# EAGLE design VC Panning Mixer CTRL (EAGLE 7.7.0)
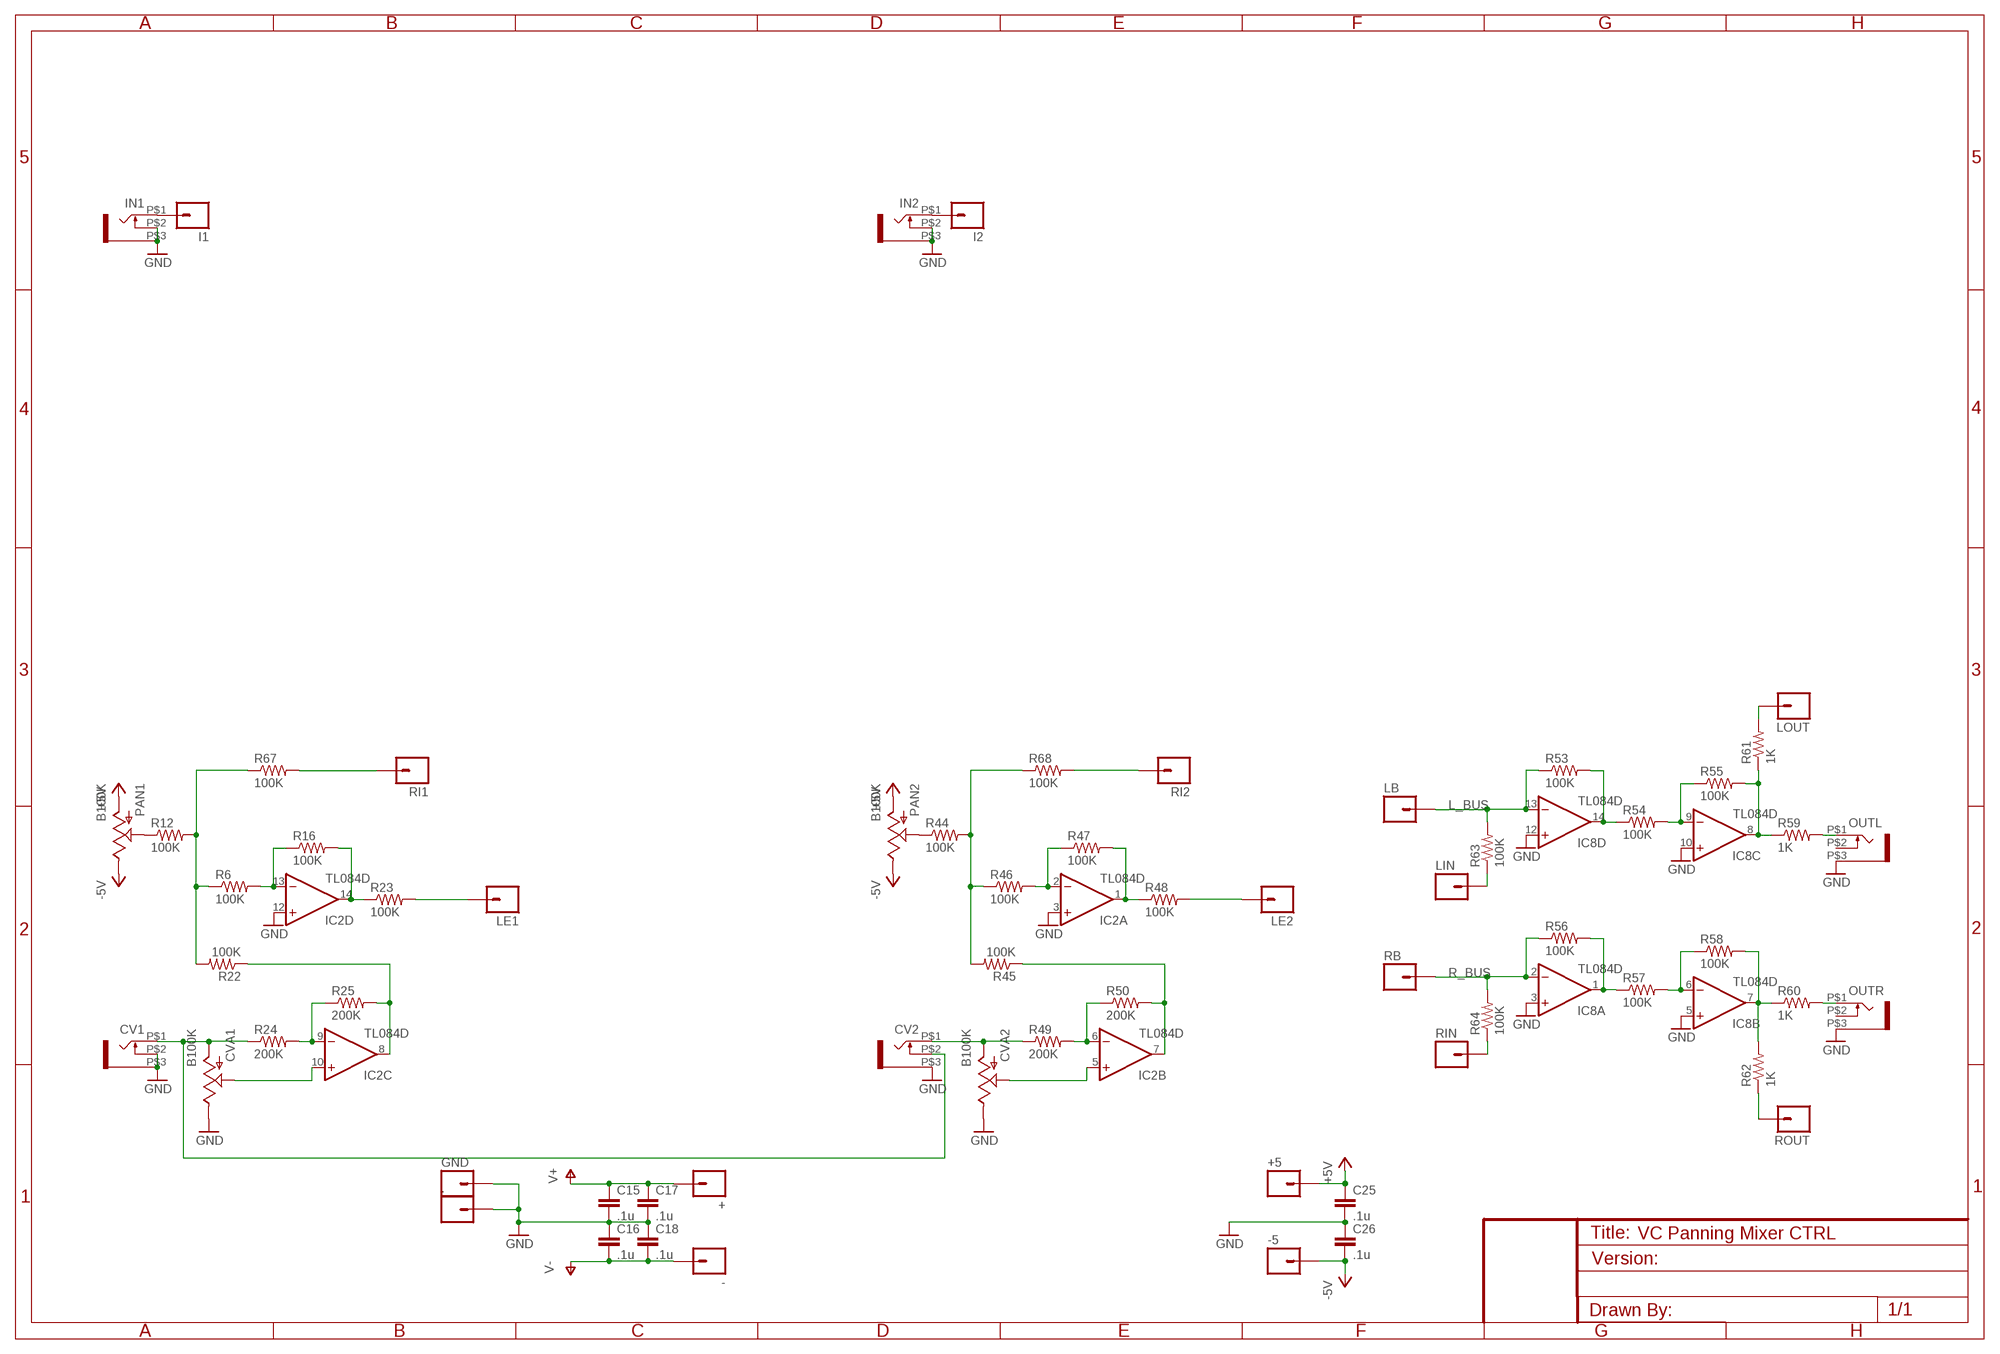
[diagram p0: schematic, sheet 1]

## Parts
+  M01PTH  [1X01]
+5  M01PTH  [1X01]
-  M01PTH  [1X01]
-5  M01PTH  [1X01]
.  M01PTH  [1X01]
C15  .1u  CAP0805  [0805]
C16  .1u  CAP0805  [0805]
C17  .1u  CAP0805  [0805]
C18  .1u  CAP0805  [0805]
C25  .1u  CAP0805  [0805]
C26  .1u  CAP0805  [0805]
CV1  WQP-PJ301M-12_JACK  [WQP-PJ301M-12_JACK]
CV2  WQP-PJ301M-12_JACK  [WQP-PJ301M-12_JACK]
CVA1  B100K  POT  [ALPS_POT]
CVA2  B100K  POT  [ALPS_POT]
GND  M01PTH  [1X01]
I1  M01PTH  [1X01]
I2  M01PTH  [1X01]
IC2  TL084D  [SO14]
IC8  TL084D  [SO14]
IN1  WQP-PJ301M-12_JACK  [WQP-PJ301M-12_JACK]
IN2  WQP-PJ301M-12_JACK  [WQP-PJ301M-12_JACK]
LB  M01PTH  [1X01]
LE1  M01PTH  [1X01]
LE2  M01PTH  [1X01]
LIN  M01PTH  [1X01]
LOUT  M01PTH  [1X01]
OUTL  WQP-PJ301M-12_JACK  [WQP-PJ301M-12_JACK]
OUTR  WQP-PJ301M-12_JACK  [WQP-PJ301M-12_JACK]
PAN1  B100K  POT  [ALPS_POT]
PAN2  B100K  POT  [ALPS_POT]
R6  100K  RESISTOR0805-RES  [0805]
R12  100K  RESISTOR0805-RES  [0805]
R16  100K  RESISTOR0805-RES  [0805]
R22  100K  RESISTOR0805-RES  [0805]
R23  100K  RESISTOR0805-RES  [0805]
R24  200K  RESISTOR0805-RES  [0805]
R25  200K  RESISTOR0805-RES  [0805]
R44  100K  RESISTOR0805-RES  [0805]
R45  100K  RESISTOR0805-RES  [0805]
R46  100K  RESISTOR0805-RES  [0805]
R47  100K  RESISTOR0805-RES  [0805]
R48  100K  RESISTOR0805-RES  [0805]
R49  200K  RESISTOR0805-RES  [0805]
R50  200K  RESISTOR0805-RES  [0805]
R53  100K  RESISTOR0805-RES  [0805]
R54  100K  RESISTOR0805-RES  [0805]
R55  100K  RESISTOR0805-RES  [0805]
R56  100K  RESISTOR0805-RES  [0805]
R57  100K  RESISTOR0805-RES  [0805]
R58  100K  RESISTOR0805-RES  [0805]
R59  1K  RESISTOR0805-RES  [0805]
R60  1K  RESISTOR0805-RES  [0805]
R61  1K  RESISTOR0805-RES  [0805]
R62  1K  RESISTOR0805-RES  [0805]
R63  100K  RESISTOR0805-RES  [0805]
R64  100K  RESISTOR0805-RES  [0805]
R67  100K  RESISTOR0805-RES  [0805]
R68  100K  RESISTOR0805-RES  [0805]
RB  M01PTH  [1X01]
RI1  M01PTH  [1X01]
RI2  M01PTH  [1X01]
RIN  M01PTH  [1X01]
ROUT  M01PTH  [1X01]

## Nets
+5V: +5.1 C25.1 PAN1.P$3(A) PAN2.P$3(A)
-5V: -5.1 C26.2 PAN1.P$1(E) PAN2.P$1(E)
GND: ..1 C15.2 C16.1 C17.2 C18.1 C25.2 C26.1 CV1.P$2 CV1.P$3 CV2.P$3 CVA1.P$1(E) CVA2.P$1(E) GND.1 IC2.3(A:+IN) IC2.12(D:+IN) IC8.3(A:+IN) IC8.5(B:+IN) IC8.10(C:+IN) IC8.12(D:+IN) IN1.P$2 IN1.P$3 IN2.P$2 IN2.P$3 OUTL.P$3 OUTR.P$3
L_BUS: IC8.13(D:-IN) LB.1 R53.1 R63.2
N$1: R68.2 RI2.1
N$2: R67.2 RI1.1
N$4: I1.1 IN1.P$1
N$5: I2.1 IN2.P$1
N$6: R6.1 R12.2 R22.2 R67.1
N$7: LE1.1 R23.2
N$8: LE2.1 R48.2
N$9: R44.2 R45.2 R46.1 R68.1
N$11: PAN1.P$2(S) R12.1
N$26: CV1.P$1 CV2.P$2 CVA1.P$3(A) R24.1
N$27: CVA1.P$2(S) IC2.10(C:+IN)
N$28: IC2.9(C:-IN) R24.2 R25.1
N$29: IC2.8(C:OUT) R22.1 R25.2
N$30: IC2.13(D:-IN) R6.2 R16.1
N$31: IC2.14(D:OUT) R16.2 R23.1
N$55: PAN2.P$2(S) R44.1
N$56: CV2.P$1 CVA2.P$3(A) R49.1
N$57: CVA2.P$2(S) IC2.5(B:+IN)
N$58: IC2.6(B:-IN) R49.2 R50.1
N$59: IC2.7(B:OUT) R45.1 R50.2
N$60: IC2.2(A:-IN) R46.2 R47.1
N$61: IC2.1(A:OUT) R47.2 R48.1
N$62: IC8.14(D:OUT) R53.2 R54.1
N$63: IC8.9(C:-IN) R54.2 R55.1
N$64: IC8.8(C:OUT) R55.2 R59.1 R61.1
N$65: IC8.1(A:OUT) R56.2 R57.1
N$66: IC8.6(B:-IN) R57.2 R58.1
N$67: IC8.7(B:OUT) R58.2 R60.1 R62.2
N$68: OUTL.P$1 R59.2
N$69: OUTR.P$1 R60.2
N$70: R64.1 RIN.1
N$71: LIN.1 R63.1
N$72: LOUT.1 R61.2
N$74: R62.1 ROUT.1
R_BUS: IC8.2(A:-IN) R56.1 R64.2 RB.1
V+: +.1 C15.1 C17.1
V-: -.1 C16.2 C18.2
Unconnected: OUTL.P$2 OUTR.P$2

## Power pins joined to a net without a drawn wire
V+: IC2.4(P:V+) IC8.4(P:V+)
V-: IC2.11(P:V-) IC8.11(P:V-)

## Library data of the parts
+ +5 - -5 . GND I1 I2 LB LE1 LE2 LIN LOUT RB RI1 RI2 RIN ROUT = SparkFun-Connectors:M01: Header 1 Standard 1-pin 0.1" header. Use with straight break away headers (SKU : PRT-00116), right angle break away headers (PRT-00553), swiss pins (PRT-00743), machine pins (PRT-00117), and female headers (PRT-00115).
C15-C18 C25 C26 = SparkFun-Capacitors:CAP: Capacitor Standard 0603 ceramic capacitor, and 0.1" leaded capacitor.
CV1 CV2 IN1 IN2 OUTL OUTR = thonkiconn:WQP-PJ301M-12_JACK
CVA1 CVA2 PAN1 PAN2 = SparkFun-Electromechanical:POT; PROD_ID: RES-09177
IC2 IC8 = linear:TL084: OP AMP
R6 R12 R16 R22-R25 R44-R50 R53-R64 R67 R68 = SparkFun-Resistors:RESISTOR: Resistor Basic schematic elements and footprints for 0603, 1206, and PTH resistors.

## Board
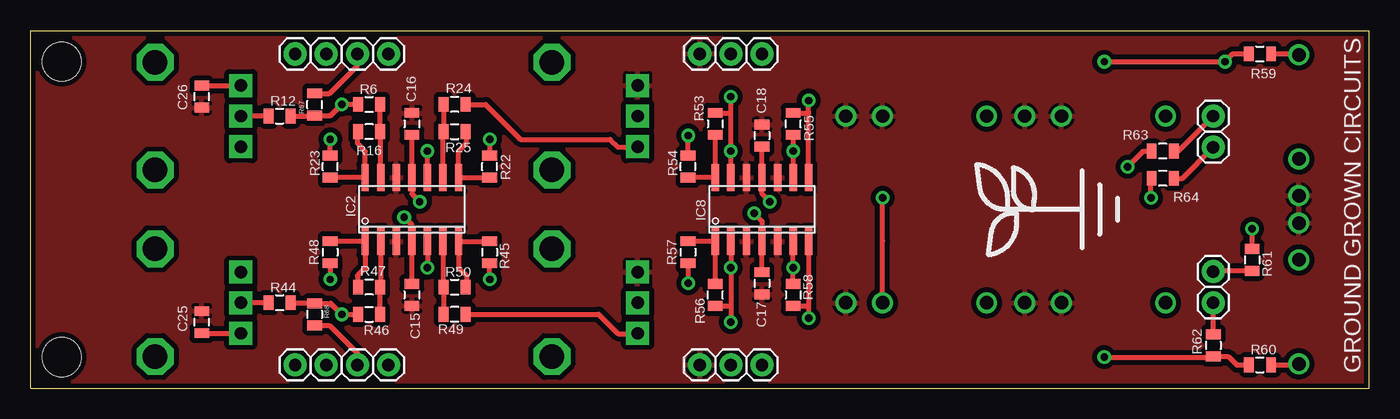
[diagram p1: board, top side]
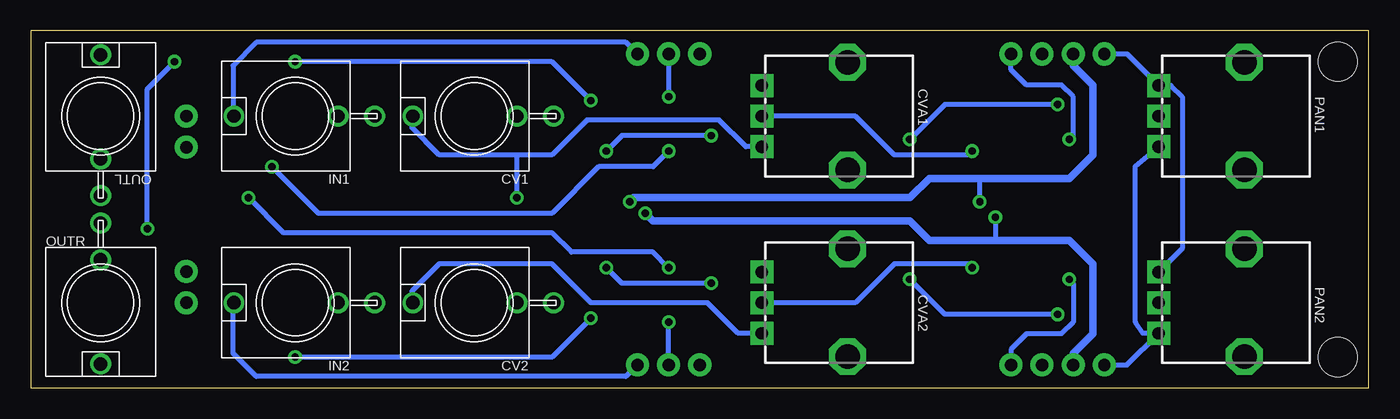
[diagram p2: board, bottom side, seen from below]

Size 109.22 x 29.21 mm. Coordinates in mm from the lower left corner, seen from the top.
Outline: 0,0 109.22,0 109.22,29.21 0,29.21 0,0
Copper layers (1*16): Top 0.035mm / dielectric 1.5mm / Bottom 0.035mm
Design rules "SparkFun": minimum track width 8mil, minimum drill 20mil, track to track 8mil, track to pad 8mil, pad to pad 8mil, via to via 8mil, smd to smd 8mil, copper to edge 8mil, drill to drill 8mil, minimum pad ring 12mil, minimum via ring 10mil, stop-mask expansion 4mil, vias tented up to drill 20mil, thermal gap 10mil
Holes 3.2 mm at 2.54,26.67 2.54,2.54

### Footprints (pad centres in the part's own frame; a part is rotated, then mirrored left to right if it is on the bottom)
1X01 = drill 1.016 pad 1.88: 1 0,0
0805 = smd 0.8 x 1.2: 1 -0.9,0; 2 0.9,0
WQP-PJ301M-12_JACK = drill 1.1: P$1 0,5; P$2 0,-3.5; P$3 0,-6.5
ALPS_POT = drill 1 pad 1.88 square: P$1 7,-2.5; P$2 7,0; P$3 7,2.5 | drill 2 octagon: P$4 0,-4.4; P$5 0,4.4
SO14 = smd 0.6 x 2.2: 1 -3.81,-2.6; 2 -2.54,-2.6; 3 -1.27,-2.6; 4 0,-2.6; 5 1.27,-2.6; 6 2.54,-2.6; 7 3.81,-2.6; 8 3.81,2.6; 9 2.54,2.6; 10 1.27,2.6; 11 0,2.6; 12 -1.27,2.6; 13 -2.54,2.6; 14 -3.81,2.6

### Placement (x,y rotation side)
+  24.13,1.91 0 top
+5  21.59,1.91 0 top
-  24.13,27.3 180 top
-5  21.59,27.3 180 top
.  54.61,27.3 180 top
C15  31.11,7.62 270 top
C16  31.11,21.59 270 top
C17  59.69,8.57 270 top
C18  59.69,20.64 270 top
C25  13.97,5.4 90 top
C26  13.97,23.81 90 top
CV1  73.03,22.23 90 bottom
CV2  73.03,6.99 90 bottom
CVA1  42.55,22.23 180 bottom
CVA2  42.55,6.99 180 bottom
GND  54.61,1.91 0 top
I1  59.69,27.3 180 top
I2  59.69,1.91 0 top
IC2  31.11,14.61 0 top
IC8  59.69,14.61 0 top
IN1  87.63,22.23 90 bottom
IN2  87.63,6.99 90 bottom
LB  57.15,27.3 180 top
LE1  29.21,27.3 180 top
LE2  29.21,1.91 0 top
LIN  96.52,22.23 270 top
LOUT  96.52,9.53 90 top
OUTL  103.5,22.23 0 bottom
OUTR  103.5,6.99 180 bottom
PAN1  10.16,22.23 180 bottom
PAN2  10.16,6.99 180 bottom
R6  27.62,23.18 0 top
R12  20.32,22.23 0 top
R16  27.62,20.95 180 top
R22  37.47,18.1 90 top
R23  24.45,18.1 90 top
R24  34.61,23.18 180 top
R25  34.61,20.95 0 top
R44  20.32,6.99 0 top
R45  37.47,11.11 270 top
R46  27.62,6.03 0 top
R47  27.62,8.26 180 top
R48  24.45,11.11 270 top
R49  34.61,6.03 180 top
R50  34.61,8.26 0 top
R53  55.88,21.59 270 top
R54  53.66,18.1 90 top
R55  62.23,21.59 90 top
R56  55.88,7.62 90 top
R57  53.66,11.11 270 top
R58  62.23,7.62 270 top
R59  100.33,27.3 0 top
R60  100.33,1.91 0 top
R61  99.69,10.48 270 top
R62  96.52,3.49 270 top
R63  92.39,19.37 180 top
R64  92.39,17.14 180 top
R67  23.18,23.18 90 top
R68  23.18,6.03 270 top
RB  57.15,1.91 0 top
RI1  26.67,27.3 180 top
RI2  26.67,1.91 0 top
RIN  96.52,19.68 270 top
ROUT  96.52,6.99 90 top
U$1  [LOGO_MED]  85.72,14.61 90 top

### Tracks (layer width: path | path; a pad name or v marks a point on that pad's centre or on a via)
+5V
  Top 0.406: C25.1 17.15,4.5 PAN2.P$3
  Bottom 0.406: +5.1 19.74,1.91 PAN2.P$3 18.45,4.49 19.05,5.4 19.05,18.15 PAN1.P$3
-5V
  Top 0.406: C26.2 17.15,24.71 PAN1.P$1
  Bottom 0.406: -5.1 19.74,27.3 PAN1.P$1 16.15,24.73 15.24,23.81 15.24,11.4 PAN2.P$1
GND
  pour Top (isolate 0.406): 0,0 109.22,0 109.22,29.21 0,29.21
L_BUS  (via drill 0.6)
  Top 0.406: v57.15,23.81 57.15,22.54 57.1,22.49 | R53.1 57.1,22.49 | IC8.13 v57.15,19.37 57.15,22.44 57.1,22.49 | v89.53,18.1 90.81,19.37 R63.2
  Bottom 0.406: LB.1 v57.15,23.81 | v57.15,19.37 58.42,18.1 62.87,18.1 66.67,14.29 85.72,14.29 v89.53,18.1
N$1
  Top 0.406: R68.2 24.39,5.13 26.67,2.86 RI2.1
N$2
  Top 0.406: R67.2 24.39,24.08 26.67,26.35 RI1.1
N$4
  Bottom 0.406: I1.1 60.64,28.26 90.81,28.26 92.71,26.35 92.71,22.3 IN1.P$1
N$5
  Bottom 0.406: I2.1 60.64,0.95 90.81,0.95 92.71,2.86 92.71,6.91 IN2.P$1
N$6  (via drill 0.6)
  Top 0.406: v37.47,20.32 R22.2 | R6.1 v25.4,23.18 24.5,22.28 R67.1 23.12,22.23 R12.2
  Bottom 0.406: v25.4,23.18 34.61,23.18 v37.47,20.32
N$7  (via drill 0.6)
  Top 0.406: R23.2 v24.45,20.32
  Bottom 0.406: v24.45,20.32 24.13,20.64 24.13,23.81 25.08,24.77 27.94,24.77 29.21,26.04 LE1.1
N$8  (via drill 0.6)
  Top 0.406: R48.2 v24.45,8.89
  Bottom 0.406: v24.45,8.89 24.13,8.57 24.13,5.4 25.08,4.45 27.94,4.45 29.21,3.17 LE2.1
N$9  (via drill 0.6)
  Top 0.406: v37.47,8.89 R45.2 | R46.1 v25.4,6.03 24.5,6.93 R68.1 23.18,6.99 R44.2
  Bottom 0.406: v25.4,6.03 34.61,6.03 v37.47,8.89
N$11
  Top 0.406: R12.1 PAN1.P$2
N$26  (via drill 0.6)
  Top 0.406: R24.1 37.15,23.18 40.01,20.32 47.31,20.32 47.94,19.68 49.51,19.68 CVA1.P$3 | CV2.P$2 69.53,12.06 v69.53,15.56
  Bottom 0.406: CVA1.P$3 50.84,19.73 53.02,21.91 63.82,21.91 66.67,19.05 69.53,19.05 | 69.53,19.05 75.88,19.05 78.11,21.27 78.11,22.14 CV1.P$1 | v69.53,15.56 69.53,19.05
N$27  (via drill 0.6)
  Top 0.406: IC2.10 v32.38,19.37
  Bottom 0.406: v32.38,19.37 32.7,19.05 38.73,19.05 41.91,22.23 CVA1.P$2
N$28
  Top 0.406: R24.2 R25.1 33.66,20.9 IC2.9
N$29
  Top 0.406: R25.2 35.56,20.9 35.56,20 34.92,19.37 IC2.8 37.46,17.2 R22.1
N$30
  Top 0.406: R6.2 R16.1 28.57,20.9 IC2.13
N$31
  Top 0.406: R16.2 26.67,20.9 26.67,20 27.3,19.37 IC2.14 R23.1
N$55
  Top 0.406: R44.1 PAN2.P$2
N$56
  Top 0.406: R49.1 46.35,6.03 47.94,4.45 49.51,4.45 CVA2.P$3
  Bottom 0.406: CVA2.P$3 51.48,4.49 53.98,6.99 63.5,6.99 66.67,10.16 75.88,10.16 78.11,7.94 78.11,7.07 CV2.P$1
N$57  (via drill 0.6)
  Top 0.406: IC2.5 v32.38,9.84
  Bottom 0.406: v32.38,9.84 32.7,10.16 38.73,10.16 41.91,6.99 CVA2.P$2
N$58
  Top 0.406: IC2.6 33.66,8.31 R50.1 R49.2
N$59
  Top 0.406: R50.2 35.56,8.31 35.56,9.21 34.92,9.84 IC2.7 37.46,12.01 R45.1
N$60
  Top 0.406: R46.2 R47.1 28.57,8.31 IC2.2
N$61
  Top 0.406: R47.2 26.67,8.31 26.67,9.21 27.3,9.84 IC2.1 R48.1
N$62
  Top 0.406: R53.2 IC8.14 R54.1
N$63  (via drill 0.6)
  Top 0.406: R54.2 v53.66,20.64 | IC8.9 v62.23,19.37 R55.1
  Bottom 0.406: v53.66,20.64 60.96,20.64 v62.23,19.37
N$64  (via drill 0.6)
  Top 0.406: R55.2 63.45,22.49 | 63.45,22.49 63.5,22.54 v63.5,23.5 | v87.63,26.67 v97.47,26.67 98.11,27.3 R59.1 | R61.1 v99.69,13.02 | IC8.8 63.5,22.44 63.45,22.49
  Bottom 0.406: v63.5,23.5 66.67,26.67 v87.63,26.67 | v99.69,13.02 99.69,24.45 v97.47,26.67
N$65
  Top 0.406: R56.2 IC8.1 R57.1
N$66  (via drill 0.6)
  Top 0.406: R57.2 v53.66,8.57 | IC8.6 v62.23,9.84 R58.1
  Bottom 0.406: v53.66,8.57 60.96,8.57 v62.23,9.84
N$67  (via drill 0.6)
  Top 0.406: R58.2 63.45,6.72 | 63.45,6.72 63.5,6.67 v63.5,5.71 | v87.63,2.54 96.47,2.54 R62.2 97.74,2.59 98.42,1.91 R60.1 | IC8.7 63.5,6.77 63.45,6.72
  Bottom 0.406: v63.5,5.71 66.67,2.54 v87.63,2.54
N$68
  Top 0.406: R59.2 103.42,27.3 OUTL.P$1
N$69
  Top 0.406: R60.2 103.42,1.91 OUTR.P$1
N$70
  Top 0.406: R64.1 93.98,17.14 RIN.1
N$71
  Top 0.406: R63.1 93.66,19.37 LIN.1
N$72
  Top 0.406: R61.2 96.57,9.58 LOUT.1
N$74
  Top 0.406: R62.1 ROUT.1
R_BUS  (via drill 0.6)
  Top 0.406: v57.15,5.4 57.15,6.67 57.1,6.72 | R56.1 57.1,6.72 | IC8.2 v57.15,9.84 57.15,6.77 57.1,6.72 | v91.44,15.56 91.44,17.09 R64.2
  Bottom 0.406: RB.1 v57.15,5.4 | v57.15,9.84 58.42,11.11 65.09,11.11 66.67,12.7 88.58,12.7 v91.44,15.56
V+  (via drill 0.6)
  Top 0.406: v59.05,14.29 59.69,13.65 IC8.4 C17.1 | v30.48,13.97 31.11,13.34 IC2.4 C15.1
  Bottom 0.406: v30.48,13.97 30.48,12.06
  Bottom 0.61: +.1 24.13,2.86 22.54,4.45 22.54,10.16 24.45,12.06 30.48,12.06 35.88,12.06 37.47,13.65 58.42,13.65 v59.05,14.29
V-  (via drill 0.6)
  Top 0.406: v60.33,15.24 59.69,15.88 IC8.11 C18.2 | v31.75,15.24 31.11,15.88 IC2.11 C16.2
  Bottom 0.406: v31.75,15.24 31.75,17.14
  Bottom 0.61: -.1 24.13,26.35 22.54,24.77 22.54,19.05 24.45,17.14 31.75,17.14 35.88,17.14 37.47,15.56 60.01,15.56 v60.33,15.24

### Text on the board
tPlace: GROUND GROWN CIRCUITS